# EasyEDA Pro project ProPrj_Hitboard PCB v1.0 Forever_2025-12-19.epro

# Board PCB1
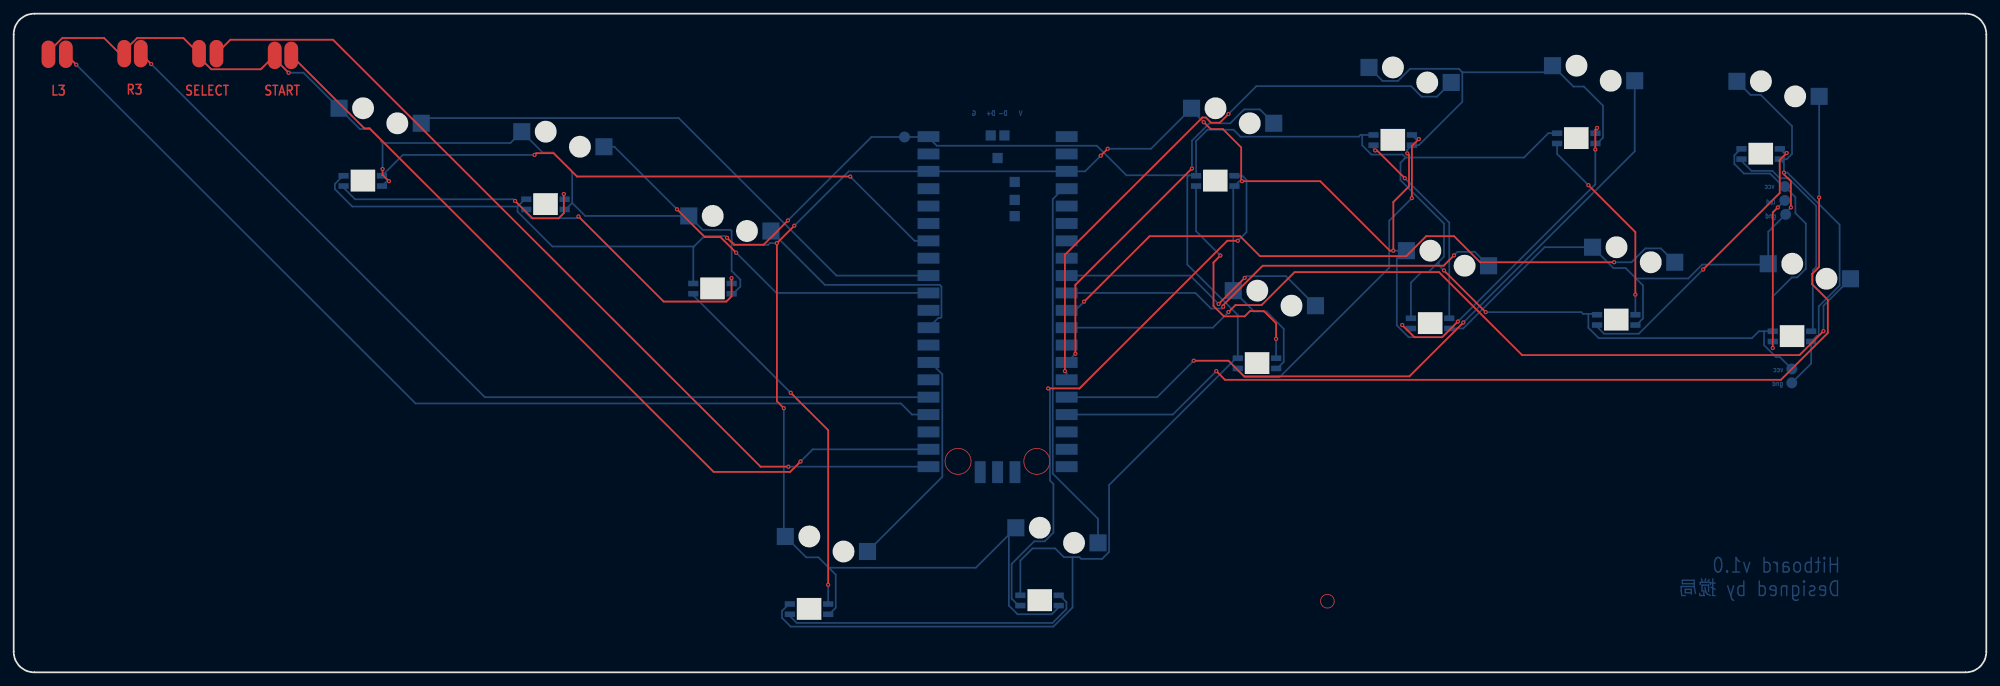
[diagram p0: board, top side]
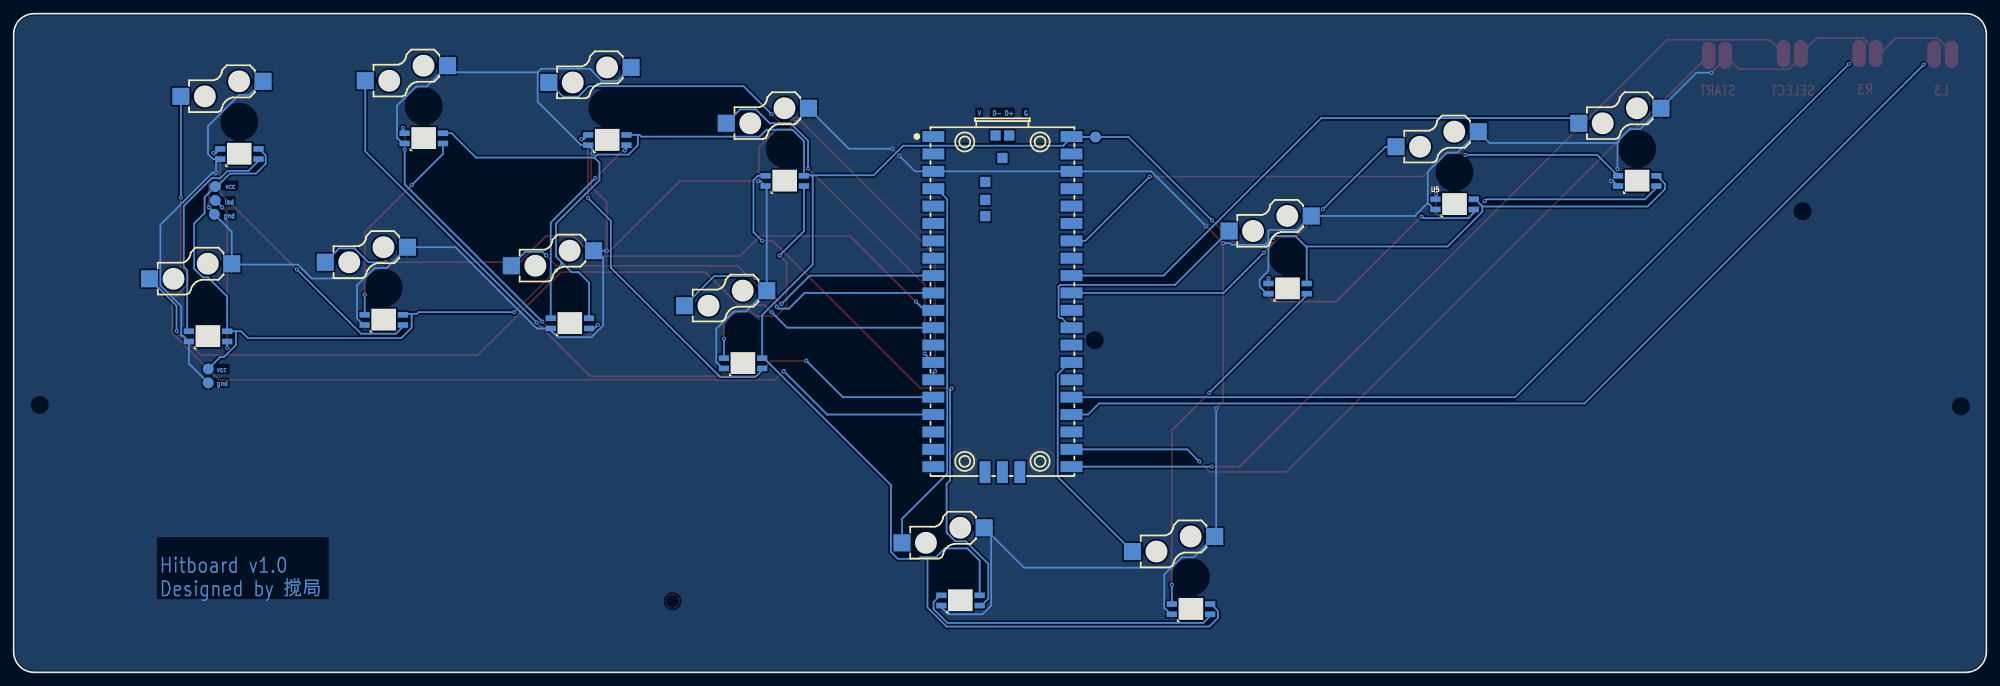
[diagram p1: board, bottom side, seen from below]

Outline 288 x 96.3 mm; copper layers: Top Layer, Bottom Layer. Coordinates in mm from the lower left corner of the outline.
Outline path: 0,93.3 0,3 arc(0.88,0.88) 3,0 285,0 arc(287.12,0.88) 288,3 288,93.3 arc(287.12,95.42) 285,96.3 3,96.3 arc(0.88,95.42) 0,93.3
Stack: Top Layer 0.035mm / Dielectric1 1.51mm FR4 er 4.5 / Bottom Layer 0.035mm

## Design rules (mm)
template: JLCPCB Capability(Two Layers Board)
spacing copperThickness1oz (default): track to track 0.102, other pairs 0.152 to 0.3
spacing copperThickness2oz: track to track 0.203, other pairs 0.152 to 0.3
track width copperThickness1oz (default): min 0.127, default 0.254, max 2.54
track width copperThickness2oz: min 0.203, default 0.254, max 2.54
differential pair differentialPair (default): width min 0.127, default 0.254, max 2.54; gap min 0.152, default 0.152
via viaSize (default): diameter min 0.5, default 0.61, max 10; hole min 0.3, default 0.305, max 6.3

## Placement (name value [footprint] x y rotation side)
NOREF  -  [Pad_e678]  18.55 90.46 0 top
NOREF#2  -  [Pad_e696]  259.6 42.32 0 top
NOREF#3  -  [Pad_e676]  7.61 90.37 0 top
NOREF#4  -  [Pad_e677]  16.14 90.46 0 top
NOREF#5  -  [Pad_e681]  38.11 90.2 0 top
NOREF#6  -  [Pad_e697]  259.6 44.36 0 top
NOREF#7  -  [Pad_e687]  130.06 78.27 0 top
NOREF#8  -  [Pad_e680]  29.6 90.46 0 top
NOREF#9  -  [Pad_e699]  258.58 68.99 0 top
NOREF#10  -  [Pad_e700]  258.58 71.03 0 top
NOREF#11  -  [Pad_e675]  5.07 90.37 0 top
NOREF#12  -  [Pad_e682]  40.52 90.2 0 top
NOREF#13  -  [Pad_e698]  258.71 66.96 0 top
NOREF#14  -  [Pad_e679]  27.06 90.46 0 top
U1  PICO  [COMM-SMD_L51.0-W21.0-P2.54_SC0916]  143.65 53.88 270 bottom
U5  -  [LED-SMD_L3.2-W2.8_YO-WS2812B-3528]  50.96 71.85 180 bottom
U5#2  -  [LED-SMD_L3.2-W2.8_YO-WS2812B-3528]  77.63 68.42 180 bottom
U5#3  -  [LED-SMD_L3.2-W2.8_YO-WS2812B-3528]  102.02 56.1 180 bottom
U5#4  -  [LED-SMD_L3.2-W2.8_YO-WS2812B-3528]  116.12 9.24 180 bottom
U5#5  -  [LED-SMD_L3.2-W2.8_YO-WS2812B-3528]  149.77 10.51 180 bottom
U5#6  -  [LED-SMD_L3.2-W2.8_YO-WS2812B-3528]  175.42 71.85 180 bottom
U5#7  -  [LED-SMD_L3.2-W2.8_YO-WS2812B-3528]  181.52 45.18 180 bottom
U5#8  -  [LED-SMD_L3.2-W2.8_YO-WS2812B-3528]  201.33 77.82 180 bottom
U5#9  -  [LED-SMD_L3.2-W2.8_YO-WS2812B-3528]  206.79 51.02 180 bottom
U5#10  -  [LED-SMD_L3.2-W2.8_YO-WS2812B-3528]  228.13 78.07 180 bottom
U5#11  -  [LED-SMD_L3.2-W2.8_YO-WS2812B-3528]  233.97 51.53 180 bottom
U5#12  -  [LED-SMD_L3.2-W2.8_YO-WS2812B-3528]  255.05 75.79 180 bottom
U5#13  -  [LED-SMD_L3.2-W2.8_YO-WS2812B-3528]  259.63 49.12 180 bottom
U6  -  [CONN-SMD_HOTPLUGPAKAGE__C9900010116-1]  53.5 81.37 180 bottom
U6#2  -  [CONN-SMD_HOTPLUGPAKAGE__C9900010116-1]  80.17 77.94 180 bottom
U6#3  -  [CONN-SMD_HOTPLUGPAKAGE__C9900010116-1]  104.56 65.63 180 bottom
U6#4  -  [CONN-SMD_HOTPLUGPAKAGE__C9900010116-1]  118.66 18.76 180 bottom
U6#5  -  [CONN-SMD_HOTPLUGPAKAGE__C9900010116-1]  152.31 20.03 180 bottom
U6#6  -  [CONN-SMD_HOTPLUGPAKAGE__C9900010116-1]  177.96 81.37 180 bottom
U6#7  -  [CONN-SMD_HOTPLUGPAKAGE__C9900010116-1]  184.06 54.7 180 bottom
U6#8  -  [CONN-SMD_HOTPLUGPAKAGE__C9900010116-1]  203.87 87.34 180 bottom
U6#9  -  [CONN-SMD_HOTPLUGPAKAGE__C9900010116-1]  209.33 60.55 180 bottom
U6#10  -  [CONN-SMD_HOTPLUGPAKAGE__C9900010116-1]  230.67 87.6 180 bottom
U6#11  -  [CONN-SMD_HOTPLUGPAKAGE__C9900010116-1]  236.51 61.05 180 bottom
U6#12  -  [CONN-SMD_HOTPLUGPAKAGE__C9900010116-1]  257.59 85.31 180 bottom
U6#13  -  [CONN-SMD_HOTPLUGPAKAGE__C9900010116-1]  262.17 58.64 180 bottom

## Footprints (pads in the part's own frame, mm; a bottom-side part is the same pattern mirrored in y, then rotated)
COMM-SMD_L51.0-W21.0-P2.54_SC0916
  rect 1.6x3.2 smd: 1(-24.445,-10.088) 2(-21.905,-10.088) 3(-19.365,-10.088) 4(-16.825,-10.088) 5(-14.285,-10.088) 6(-11.745,-10.088) 7(-9.205,-10.088) 8(-6.665,-10.088) 9(-4.125,-10.088) 10(-1.585,-10.088) 11(0.955,-10.088) 12(3.495,-10.088) 13(6.035,-10.088) 14(8.575,-10.088) 15(11.115,-10.088) 16(13.655,-10.088) 17(16.195,-10.088) 18(18.735,-10.088) 19(21.275,-10.088) 20(23.815,-10.088) 21(23.815,10.088) 22(21.275,10.088) 23(18.735,10.088) 24(16.195,10.088) 25(13.655,10.088) 26(11.115,10.088) 27(8.575,10.088) 28(6.035,10.088) 29(3.495,10.088) 30(0.955,10.088) 31(-1.585,10.088) 32(-4.125,10.088) 33(-6.665,10.088) 34(-9.205,10.088) 35(-11.745,10.088) 36(-14.285,10.088) 37(-16.825,10.088) 38(-19.365,10.088) 39(-21.905,10.088) 40(-24.445,10.088)
  rect 3.2x1.6 smd: 41(24.615,-2.54) 42(24.615,0) 43(24.615,2.54)
  rect 1.5x1.5 smd: TP1(-21.315,0) TP2(-24.615,1) TP3(-24.615,-1) TP4(-17.815,-2.5) TP5(-15.188,-2.5) TP6(-12.815,-2.5)
CONN-SMD_HOTPLUGPAKAGE__C9900010116-1
  rect 2.5x2.5 smd: 1(-6,-1.1) 2(6,1.1)
LED-SMD_L3.2-W2.8_YO-WS2812B-3528
  rect 1.5x0.82 smd: 1(2.8,0.75) 2(2.8,-0.75) 3(-2.8,-0.75) 4(-2.8,0.75)
Pad_e675
  oval 2x4 smd: 1(0,0)
Pad_e676
  oval 2x4 smd: 1(0,0)
Pad_e677
  oval 2x4 smd: 1(0,0)
Pad_e678
  oval 2x4 smd: 1(0,0)
Pad_e679
  oval 2x4 smd: 1(0,0)
Pad_e680
  oval 2x4 smd: 1(0,0)
Pad_e681
  oval 2x4 smd: 1(0,0)
Pad_e682
  oval 2x4 smd: 1(0,0)
Pad_e687
  round 1.6 smd far side: PTH(0,0)
Pad_e696
  round 1.6 smd far side: PTH(0,0)
Pad_e697
  round 1.6 smd far side: PTH(0,0)
Pad_e698
  round 1.6 smd far side: PTH(0,0)
Pad_e699
  round 1.6 smd far side: PTH(0,0)
Pad_e700
  round 1.6 smd far side: PTH(0,0)

## Nets
GND: NOREF#2.PTH NOREF#4.1 NOREF#5.1 NOREF#11.1 NOREF#13.PTH NOREF#14.1 U1.3 U1.38 U5.3 U5#2.3 U5#3.3 U5#4.3 U5#5.3 U5#6.3 U5#7.3 U5#8.3 U5#9.3 U5#10.3 U5#11.3 U5#12.3 U5#13.3 U6.2 U6#2.2 U6#3.2 U6#4.2 U6#5.2 U6#6.2 U6#7.2 U6#8.2 U6#9.2 U6#10.2 U6#11.2 U6#12.2 U6#13.2
VCC: NOREF#6.PTH NOREF#7.PTH NOREF#10.PTH U1.40 U5.1 U5#2.1 U5#3.1 U5#4.1 U5#5.1 U5#6.1 U5#7.1 U5#8.1 U5#9.1 U5#10.1 U5#11.1 U5#12.1 U5#13.1
2: U5.2 U5#2.4
3: U5#2.2 U5#3.4
4: U5#3.2 U5#4.4
5: U5#4.2 U5#5.4
6: U5#5.2 U5#6.4
7: U5#6.2 U5#7.4
8: U5#7.2 U5#8.4
9: U5#8.2 U5#9.4
10: U5#9.2 U5#10.4
11: U5#10.2 U5#11.4
12: U5#11.2 U5#12.4
13: U5#12.2 U5#13.4
14: NOREF#9.PTH U5#13.2
A: U1.9 U6#7.1
B: U1.10 U6#9.1
CAPTURE: U1.27 U6#4.1
DOWN: U1.31 U6#2.1
HOME: U1.26
L3: NOREF#3.1 U1.24
LB: U1.17 U6#12.1
LED1: U1.34 U5.4
LEFT: U1.32 U6.1
LT: U1.12 U6#13.1
R3: NOREF.1 U1.25
RB: U1.16 U6#10.1
RIGHT: U1.29 U6#3.1
RT: U1.11 U6#11.1
SELECT: NOREF#8.1 U1.21
START: NOREF#12.1 U1.22
UP: U1.4 U6#5.1
X: U1.14 U6#6.1
Y: U1.15 U6#8.1

Pads without a net: U1 1 2 5 6 7 8 13 18 19 20 23 28 30 33 35 36 37 39 41 42 43 TP1 TP2 TP3 TP4 TP5 TP6

## Via types
v1: diameter 0.61, hole 0.305, Top Layer to Bottom Layer, 66 vias

## Routing (per net, layer and track width the routed paths; a pad name or vN(x,y) marks a point on that pad's centre or on a via; arc(x,y) is an arc through that point)
GND: length 629.8
  Top Layer w0.254: v1(113.96,65.29) v1(111.42,62.75) 111.42,39.64 v1(112.44,38.62) ; 15.99,90.46 15.99,90.71 18.03,92.74 24.77,92.74 NOREF#14.1 27.06,89.95 28.84,88.17 36.08,88.17 NOREF#5.1 38.11,89.7 v1(40.14,87.66) ; 15.99,90.46 NOREF#4.1 ; 15.99,90.46 15.49,90.46 13.2,92.74 7.1,92.74 5.07,90.71 NOREF#11.1 ; v1(54.78,71.81) 53.85,72.73 v1(53.85,73.58) ; v1(203.46,75.87) 203.71,75.62 203.71,71.04 201.43,68.76 v1(201.43,61.65) 200.92,61.65 190.76,71.81 v1(179.33,71.81) 179.21,71.92 179.21,76.75 176.54,79.43 174.76,79.43 v1(173.74,80.44) ; v1(158.71,75.53) v1(159.72,76.55) ; v1(258.45,73.06) 258.45,72.8 259.47,71.79 v1(259.47,67.98)
  Bottom Layer w0.254: v1(179.33,71.81) 178.93,71.81 U5#6.3 178.06,70.93 U6#7.2 181.11,52.76 182.89,52.76 185.43,50.22 185.43,45.39 184.47,44.43 U5#7.3 ; v1(203.46,75.87) 203.46,76.4 U5#8.3 205.15,77.07 211.5,83.42 211.5,87.74 ; 104.82,63.01 105.33,62.5 110.15,62.5 110.41,62.75 v1(111.42,62.75) ; 104.82,63.01 104.82,64.53 104.65,64.69 100.59,64.69 U6#3.2 83.45,66.73 81.54,68.63 ; 104.82,63.01 104.82,58.69 106.09,57.42 106.09,56.4 105.19,55.5 104.97,55.5 U5#3.3 ; v1(259.47,67.98) 258.71,67.22 NOREF#13.PTH 256.17,64.42 256.17,59.74 256.04,59.61 246.51,59.61 244.48,57.58 236.86,57.58 ; 81.54,68.63 81.54,73.2 78.75,76 77.22,76 U6#2.2 72.52,77.39 53.85,77.39 ; 81.54,68.63 80.58,67.67 U5#2.3 ; 119.01,15.29 120.02,14.28 120.02,9.45 119.06,8.49 U5#4.3 ; 119.01,15.29 117.48,16.81 115.7,16.81 U6#4.2 112.44,20.08 v1(112.44,38.62) ; 119.01,15.29 140.47,15.29 145.29,20.12 ; 211.5,87.74 223.71,87.74 U6#10.2 227.72,85.65 229.24,85.65 232.04,82.85 232.04,78.17 231.18,77.32 U5#10.3 ; 211.5,87.74 210.99,88.24 203.88,88.24 202.1,86.47 199.85,86.47 U6#8.2 ; U5#11.3 236.92,50.78 237.88,51.74 237.88,56.57 236.86,57.58 ; v1(113.96,65.29) 121.92,73.25 U1.38 U1.3 156.42,73.25 v1(158.71,75.53) ; 53.85,77.39 53.6,77.65 53.6,77.9 52.08,79.43 50.55,79.43 U6.2 42.31,87.66 v1(40.14,87.66) ; 53.85,77.39 v1(53.85,73.58) ; v1(54.78,71.81) 54.47,71.81 U5.3 ; 145.29,20.12 U6#5.2 ; 145.29,20.12 145.29,9.76 146.56,8.49 151.55,8.49 152.57,9.5 U5#5.3 ; 202.95,61.65 201.94,60.63 201.94,50.72 203.66,49 208.58,49 209.59,50.02 U5#9.3 211.63,50.27 223.51,62.15 U6#11.2 233.56,59.11 235.34,59.11 236.86,57.58 ; 202.95,61.65 U6#9.2 ; 202.95,61.65 v1(201.43,61.65) ; v1(173.74,80.44) 171.96,82.22 U6#6.2 166.04,76.55 v1(159.72,76.55) ; NOREF#2.PTH 262.43,45.15 U5#13.3 263.24,49.18 263.39,49.18 263.53,49.33 263.53,53.5 266.58,56.55 266.58,65.44 258.96,73.06 v1(258.45,73.06) 258.45,74.43 U5#12.3 258.87,75.04 259.63,75.8 259.63,79.86 255.06,84.43 253.57,84.43 251.59,86.41
VCC: length 483.4
  Top Layer w0.254: v1(113.04,66.07) 109.48,62.52 105.17,62.52 v1(104.15,63.53) ; v1(208.82,58.76) v1(214.92,52.66)
  Bottom Layer w0.254: 133.5,78.27 NOREF#7.PTH 125.23,78.27 v1(113.04,66.07) ; 133.5,78.27 134.77,77 158.14,77 162.45,72.68 171.6,72.68 ; 133.5,78.27 U1.40 ; U5.1 47.87,72.31 47.79,72.31 46.89,71.41 46.89,70.65 49.43,68.11 73.56,68.11 ; v1(104.15,63.53) 103.9,63.79 100.85,63.79 99.32,62.26 ; v1(208.82,58.76) 208.06,59.52 208.06,60.03 ; 154.59,16.85 153.32,16.85 152.05,18.12 148.75,18.12 146.97,16.34 U5#5.1 ; 154.59,16.85 154.59,9.48 151.8,6.69 113.44,6.69 112.17,7.96 112.17,8.97 113.19,9.99 U5#4.1 ; 154.59,16.85 155.61,16.85 155.86,16.59 158.91,16.59 159.92,17.61 159.92,27.39 178.47,45.93 U5#7.1 178.72,52.24 171.34,59.62 171.34,72.42 171.6,72.68 ; 229.9,52.41 229.14,52.41 228.89,52.66 v1(214.92,52.66) ; 229.9,52.41 231.04,52.41 U5#11.1 ; 229.9,52.41 229.9,50.37 231.43,48.85 253.78,48.85 254.79,49.87 255.56,49.87 ; 255.56,49.87 255.56,47.83 257.31,46.08 257.87,46.08 NOREF#6.PTH ; 255.56,49.87 U5#13.1 256.83,54.95 259.62,57.74 260.38,57.74 261.65,59.01 261.65,65.61 260.13,67.14 260.13,69.48 NOREF#10.PTH 258.33,71.03 256.42,72.93 252.61,72.93 251.22,74.33 251.22,75.6 252.15,76.54 U5#12.1 ; 203.23,75.27 202.47,74.5 202.47,71.96 208.82,65.61 208.82,60.79 208.06,60.03 ; 203.23,75.27 202.8,75.7 198.23,75.7 196.88,77.04 196.88,78.57 ; 203.23,75.27 220.5,75.27 224.06,78.82 U5#10.1 ; 171.6,72.68 172.55,72.68 U5#6.1 172.62,77.68 174.28,79.33 178.09,79.33 179.1,78.31 196.37,78.31 196.63,78.57 196.88,78.57 ; 99.32,62.26 99.22,62.16 U5#3.1 ; 99.32,62.26 78.64,62.26 73.56,67.34 73.56,68.11 ; 208.06,60.03 206.53,58.5 205.52,58.5 203.99,56.98 U5#9.1 ; 73.56,68.11 74.63,69.17 U5#2.1 ; 196.88,78.57 U5#8.1
2: length 38.2
  Top Layer w0.254: v1(80.32,69.93) 80.32,67.14 79.56,66.38 75.75,66.38 v1(73.21,68.92)
  Bottom Layer w0.254: U5#2.4 80.32,69.28 v1(80.32,69.93) ; U5.2 48.16,70.84 49.84,69.17 72.95,69.17 v1(73.21,68.92)
3: length 39.8
  Top Layer w0.254: v1(104.81,57.62) 104.81,54.97 104.04,54.21 94.9,54.21 v1(82.45,66.65)
  Bottom Layer w0.254: v1(104.81,57.62) 104.81,56.86 U5#3.4 ; U5#2.2 74.83,67.16 75.6,66.4 82.2,66.4 v1(82.45,66.65)
4: length 53.5
  Top Layer w0.254: v1(113.44,40.87) 118.92,35.4 v1(118.92,12.79)
  Bottom Layer w0.254: v1(113.44,40.87) 99.22,55.1 U5#3.2 ; v1(118.92,12.79) U5#4.4
5: length 44.5
  Bottom Layer w0.254: U5#4.2 113.32,8.23 114.33,7.22 151.67,7.22 153.7,9.25 153.7,10.27 152.94,11.03 152.8,11.03 U5#5.4
6: length 84.2
  Top Layer w0.254: v1(178.72,63.1) 177.2,63.1 155.61,41.51 v1(151.03,41.51)
  Bottom Layer w0.254: U5#6.4 179.38,72.6 179.99,71.99 179.99,64.37 v1(178.72,63.1) ; v1(151.03,41.51) 151.29,41.25 151.29,28.05 151.8,27.54 151.8,20.43 150.53,19.16 149,19.16 145.7,15.85 145.7,10.77 146.72,9.76 U5#5.2
7: length 35.4
  Top Layer w0.254: v1(184.31,48.75) 184.31,51.03 182.53,52.81 180.5,52.81 179.74,52.05 176.69,52.05 175.16,53.57 175.16,59.92 v1(176.18,60.94)
  Bottom Layer w0.254: v1(184.31,48.75) 184.31,45.94 U5#7.4 ; U5#6.2 172.62,64.49 v1(176.18,60.94)
8: length 51.3
  Top Layer w0.254: v1(204.13,69.33) 204.13,76.95 v1(205.15,77.97)
  Bottom Layer w0.254: v1(205.15,77.97) 204.73,77.97 U5#8.4 ; v1(204.13,69.33) 200.82,66.02 200.82,59.16 184.82,43.16 179.74,43.16 178.72,44.17 U5#7.2
9: length 30
  Top Layer w0.254: v1(203.1,72.24) 199.04,76.31 v1(198.79,76.31)
  Bottom Layer w0.254: U5#9.4 209.59,65.75 v1(203.1,72.24) ; U5#8.2 198.53,76.56 v1(198.79,76.31)
10: length 48.9
  Top Layer w0.254: v1(231.17,79.6) 230.92,79.34 v1(230.92,76.43) ; v1(210.85,51.29) 208.57,49 204.5,49 v1(202.72,50.78)
  Bottom Layer w0.254: v1(230.92,76.43) 230.92,71.35 v1(210.85,51.29) ; v1(202.72,50.78) 203.23,50.27 U5#9.2 ; v1(231.17,79.6) 231.17,79.06 U5#10.4
11: length 29.8
  Top Layer w0.254: v1(229.9,71.23) 236.76,64.37 v1(236.76,55.22)
  Bottom Layer w0.254: U5#11.4 236.76,52.29 v1(236.76,55.22) ; v1(229.9,71.23) 225.33,75.8 U5#10.2
12: length 43.4
  Top Layer w0.254: v1(246.67,58.91) 257.84,70.08 257.84,74.91 v1(258.86,75.92)
  Bottom Layer w0.254: U5#11.2 231.17,50.52 232.19,49.51 237.27,49.51 v1(246.67,58.91) ; v1(258.86,75.92) 258.46,75.92 U5#12.4
13: length 32.5
  Bottom Layer w0.254: U5#13.4 262.67,50.11 262.67,58.78 263.18,59.29 263.18,68.18 259.11,72.24 257.84,72.24 256.77,73.31 253.72,73.31 252.25,74.78 U5#12.2
14: length 23.2
  Top Layer w0.254: v1(257.57,67.98) 256.83,67.24 v1(256.83,47.43)
  Bottom Layer w0.254: NOREF#9.PTH v1(257.57,67.98) ; v1(256.83,47.43) U5#13.2
A: length 41.5
  Top Layer w0.254: v1(175.92,53.86) v1(179.73,57.67)
  Bottom Layer w0.254: U6#7.1 185.74,57.92 179.98,57.92 v1(179.73,57.67) ; v1(175.92,53.86) 171.77,58.01 U1.9
B: length 67
  Top Layer w0.254: v1(210.29,60.97) 208.77,59.45 182.35,59.45 176.59,53.69 v1(176.59,53.43)
  Bottom Layer w0.254: v1(176.59,53.43) 176.34,53.18 174.82,53.18 172.53,55.47 U1.10 ; U6#9.1 213.3,61.48 210.8,61.48 v1(210.29,60.97)
CAPTURE: length 33.2
  Bottom Layer w0.254: U1.27 133.84,45.31 135.58,43.57 135.58,28.58 124.66,17.66
DOWN: length 56.2
  Top Layer w0.254: v1(96.84,67.7) 100.91,63.64 103.19,63.64 v1(105.48,61.35)
  Bottom Layer w0.254: v1(96.84,67.7) 87.7,76.84 U6#2.1 ; U1.31 111.36,55.47 v1(105.48,61.35)
L3: length 147.8
  Top Layer w0.254: NOREF#3.1 v1(9.14,88.84)
  Bottom Layer w0.254: v1(9.14,88.84) 58.67,39.31 129.53,39.31 131.16,37.69 U1.24
LB: length 153.1
  Top Layer w0.254: v1(263.59,69.44) 263.59,59.28 262.58,58.26 262.58,56.74 264.86,54.45 264.86,49.62 258.01,42.77 176.85,42.77 v1(175.58,44.04)
  Bottom Layer w0.254: v1(175.58,44.04) 169.23,37.69 U1.17 ; v1(263.59,69.44) U6#12.1
LED1: length 86.5
  Top Layer w0.254: v1(76.04,75.65) 76.3,75.9 78.84,75.9 82.25,72.48 v1(122.13,72.48)
  Bottom Layer w0.254: v1(122.13,72.48) 131.53,63.09 U1.34 ; v1(76.04,75.65) 56.81,75.65 U5.4
LEFT: length 83.9
  Bottom Layer w0.254: U6.1 60.27,81.04 97.1,81.04 120.13,58.01 U1.32
LT: length 129.6
  Top Layer w0.254: v1(177.36,52.67) 178.37,53.69 182.18,53.69 187.01,58.52 208.09,58.52 220.22,46.39 260.73,46.39 v1(264.22,49.88)
  Bottom Layer w0.254: v1(264.22,49.88) 264.22,53.6 U6#13.1 ; U1.12 175.07,50.39 v1(177.36,52.67)
R3: length 135.8
  Top Layer w0.254: NOREF.1 v1(20.08,88.93)
  Bottom Layer w0.254: U1.25 68.78,40.23 v1(20.08,88.93)
RB: length 110
  Top Layer w0.254: v1(211.65,51.15) 203.77,43.27 179.64,43.27 177.36,45.56 v1(172.28,45.56)
  Bottom Layer w0.254: v1(211.65,51.15) 236.67,76.17 U6#10.1 ; U1.16 166.94,40.23 v1(172.28,45.56)
RIGHT: length 35.2
  Bottom Layer w0.254: U1.29 135,51.83 135.33,51.83 135.45,51.94 135.45,56.4 135.2,56.65 118.43,56.65 U6#3.1
RT: length 98.9
  Top Layer w0.254: v1(156.27,54.2) 165.84,63.76 179.05,63.76 181.96,60.85 203.31,60.85 206.23,63.76 210.29,63.76 214.1,59.95 v1(233.66,59.95)
  Bottom Layer w0.254: v1(233.66,59.95) 236.2,59.95 238.23,61.99 240.48,61.99 U6#11.1 ; v1(156.27,54.2) 155,52.93 U1.11
SELECT: length 130.7
  Top Layer w0.254: NOREF#8.1 31.63,92.49 46.62,92.49 109.04,30.07 v1(113.11,30.07)
  Bottom Layer w0.254: v1(113.11,30.07) U1.21
START: length 119.6
  Top Layer w0.254: NOREF#12.1 51.19,79.54 51.95,79.54 102.18,29.3 113.36,29.3 v1(114.88,30.83)
  Bottom Layer w0.254: v1(114.88,30.83) 116.66,32.61 U1.22
UP: length 55.6
  Bottom Layer w0.254: U1.4 153.23,70.71 151.7,69.18 151.7,29.05 158.31,22.45 158.31,18.94
X: length 54.7
  Top Layer w0.254: v1(155,46.58) 155,56.65 v1(172.02,73.67)
  Bottom Layer w0.254: U1.14 v1(155,46.58) ; v1(172.02,73.67) 172.02,77.73 174.56,80.27 177.61,80.27 179.64,82.3 181.94,82.3 U6#6.1
Y: length 87.1
  Top Layer w0.254: v1(177.36,81.63) 176.09,80.36 174.82,80.36 174.05,81.12 173.55,81.12 153.48,61.05 v1(153.48,44.04)
  Bottom Layer w0.254: U1.15 153.73,43.78 v1(153.48,44.04) ; v1(177.36,81.63) 181.42,85.69 204.03,85.69 205.55,84.17 207.8,84.17 U6#8.1

## Copper pours and planes (outline as drawn; the poured copper is in the pictures)
GND on Bottom Layer: -5.32,101.13 292.62,101.13 292.62,-2.89 -5.32,-2.89

## Text on the board
Bottom Layer: G | D+ | D- | V | vcc | led | gnd | Hitboard v1.0 / Designed by 搅局
Top Layer: L3 | R3 | SELECT | START
